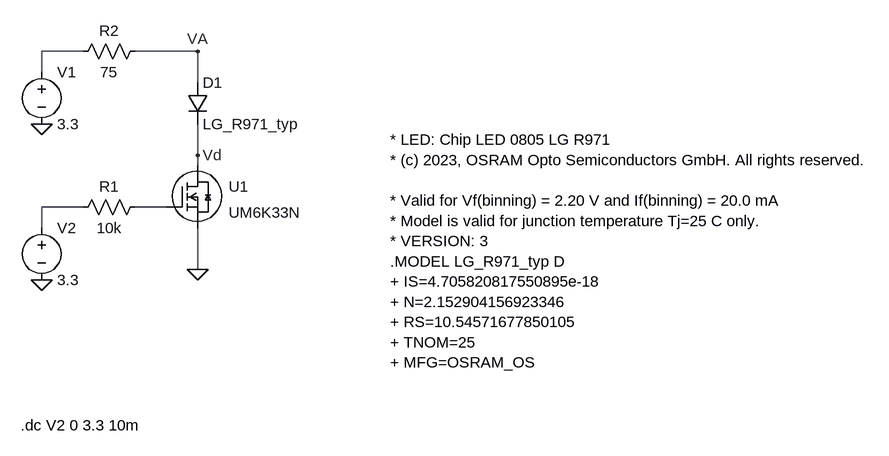
[diagram p0: schematic Nibbler-3.3V.asc]
Nibbler-3.3V.asc, the LTspice schematic file:
Version 4
SHEET 1 1228 680
WIRE -32 -96 -96 -96
WIRE 144 -96 48 -96
WIRE -96 -64 -96 -96
WIRE 144 -48 144 -96
WIRE 144 64 144 16
WIRE 144 80 144 64
WIRE -32 144 -96 144
WIRE 96 144 48 144
WIRE -96 176 -96 144
WIRE 144 240 144 176
FLAG 144 240 0
FLAG -96 256 0
FLAG -96 16 0
FLAG 144 64 Vd
FLAG 144 -96 VA
SYMBOL um6k33n 96 80 R0
SYMATTR InstName U1
SYMBOL diode 128 -48 R0
SYMATTR InstName D1
SYMATTR Value LG_R971_typ
SYMBOL res 64 128 R90
WINDOW 0 0 56 VBottom 2
WINDOW 3 32 56 VTop 2
SYMATTR InstName R1
SYMATTR Value 10k
SYMBOL res 64 -112 R90
WINDOW 0 0 56 VBottom 2
WINDOW 3 32 56 VTop 2
SYMATTR InstName R2
SYMATTR Value 75
SYMBOL voltage -96 -80 R0
WINDOW 123 0 0 Left 0
WINDOW 39 0 0 Left 0
SYMATTR InstName V1
SYMATTR Value 3.3
SYMBOL voltage -96 160 R0
WINDOW 123 0 0 Left 0
WINDOW 39 0 0 Left 0
SYMATTR InstName V2
SYMATTR Value 3.3
TEXT 440 40 Left 2 !* LED: Chip LED 0805 LG R971\n* (c) 2023, OSRAM Opto Semiconductors GmbH. All rights reserved.\n \n* Valid for Vf(binning) = 2.20 V and If(binning) = 20.0 mA\n* Model is valid for junction temperature Tj=25 C only.\n* VERSION: 3\n.MODEL LG_R971_typ D\n+ IS=4.705820817550895e-18\n+ N=2.152904156923346\n+ RS=10.54571677850105\n+ TNOM=25\n+ MFG=OSRAM_OS
TEXT -128 480 Left 2 !.dc V2 0 3.3 10m

The netlist it stands for:
* Nibbler-3.3V.asc
XU1 Vd N003 0 UM6K33N  ; pins D G S
D1 VA Vd LG_R971_typ
R1 N003 N002 10k
R2 VA N001 75
V1 N001 0 3.3
V2 N002 0 3.3
.model D D
.lib standard.dio
* LED: Chip LED 0805 LG R971
* (c) 2023, OSRAM Opto Semiconductors GmbH. All rights reserved.
* Valid for Vf(binning) = 2.20 V and If(binning) = 20.0 mA
* Model is valid for junction temperature Tj=25 C only.
* VERSION: 3
.MODEL LG_R971_typ D
+ IS=4.705820817550895e-18
+ N=2.152904156923346
+ RS=10.54571677850105
+ TNOM=25
+ MFG=OSRAM_OS
.dc V2 0 3.3 10m
.lib um6k33n_ltspice.lib
.backanno
.end